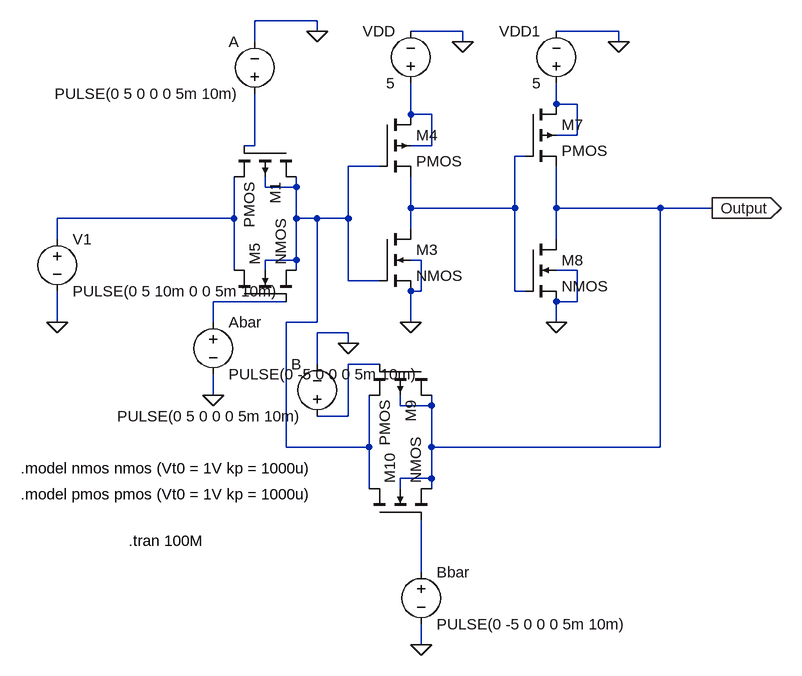
[diagram p0: schematic Exp 8 TG D flip flop.asc]
Exp 8 TG D flip flop.asc, the LTspice schematic file:
Version 4
SHEET 1 1020 792
WIRE 272 -208 176 -208
WIRE 272 -192 272 -208
WIRE 496 -192 416 -192
WIRE 736 -192 640 -192
WIRE 176 -176 176 -208
WIRE 496 -176 496 -192
WIRE 736 -176 736 -192
WIRE 640 -80 640 -112
WIRE 672 -80 640 -80
WIRE 416 -64 416 -112
WIRE 448 -64 416 -64
WIRE 672 -32 672 -80
WIRE 672 -32 640 -32
WIRE 176 -16 176 -96
WIRE 176 -16 160 -16
WIRE 448 -16 448 -64
WIRE 448 -16 416 -16
WIRE 592 0 576 0
WIRE 368 16 320 16
WIRE 192 48 192 32
WIRE 240 48 240 32
WIRE 240 48 192 48
WIRE 416 80 416 32
WIRE 576 80 576 0
WIRE 576 80 416 80
WIRE 640 80 640 16
WIRE 800 80 640 80
WIRE 880 80 800 80
WIRE 144 96 144 32
WIRE 144 96 -128 96
WIRE 240 96 240 48
WIRE 272 96 240 96
WIRE 320 96 320 16
WIRE 320 96 272 96
WIRE 416 112 416 80
WIRE -128 128 -128 96
WIRE 640 128 640 80
WIRE 240 160 240 96
WIRE 240 160 192 160
WIRE 432 160 416 160
WIRE 144 176 144 96
WIRE 192 176 192 160
WIRE 240 176 240 160
WIRE 672 176 640 176
WIRE 320 192 320 96
WIRE 368 192 320 192
WIRE 432 208 432 160
WIRE 432 208 416 208
WIRE 576 208 576 80
WIRE 592 208 576 208
WIRE 224 224 112 224
WIRE 672 224 672 176
WIRE 672 224 640 224
WIRE -128 256 -128 208
WIRE 112 256 112 224
WIRE 272 256 272 96
WIRE 272 256 224 256
WIRE 416 256 416 208
WIRE 640 256 640 224
WIRE 320 272 272 272
WIRE 320 288 320 272
WIRE 272 320 272 272
WIRE 368 320 320 320
WIRE 112 368 112 336
WIRE 400 384 400 368
WIRE 448 384 448 368
WIRE 448 384 400 384
WIRE 320 400 320 320
WIRE 320 400 272 400
WIRE 224 448 224 256
WIRE 352 448 352 368
WIRE 352 448 224 448
WIRE 448 448 448 384
WIRE 800 448 800 80
WIRE 800 448 448 448
WIRE 448 496 448 448
WIRE 448 496 400 496
WIRE 352 512 352 448
WIRE 400 512 400 496
WIRE 448 512 448 496
WIRE 432 640 432 560
WIRE 432 752 432 720
FLAG 416 256 0
FLAG 640 256 0
FLAG 496 -176 0
FLAG 736 -176 0
FLAG 320 288 0
FLAG 272 -192 0
FLAG 432 752 0
FLAG -128 256 0
FLAG 112 368 0
FLAG 880 80 Output
IOPIN 880 80 Out
SYMBOL nmos4 368 112 R0
SYMATTR InstName M3
SYMATTR Value2 l=5u w=10u
SYMBOL pmos4 368 -64 R0
SYMATTR InstName M4
SYMATTR Value2 l=5u w=20u
SYMBOL pmos4 592 -80 R0
SYMATTR InstName M7
SYMATTR Value2 l=5u w=20u
SYMBOL nmos4 592 128 R0
SYMATTR InstName M8
SYMATTR Value2 l=5u w=10u
SYMBOL voltage 416 -96 R180
WINDOW 0 24 96 Left 2
WINDOW 3 24 16 Left 2
WINDOW 123 0 0 Left 0
WINDOW 39 0 0 Left 0
SYMATTR InstName VDD
SYMATTR Value 5
SYMBOL voltage 640 -96 R180
WINDOW 0 24 96 Left 2
WINDOW 3 24 16 Left 2
WINDOW 123 0 0 Left 0
WINDOW 39 0 0 Left 0
SYMATTR InstName VDD1
SYMATTR Value 5
SYMBOL voltage 176 -80 R180
WINDOW 0 24 96 Left 2
WINDOW 3 24 16 Left 2
WINDOW 123 0 0 Left 0
WINDOW 39 0 0 Left 0
SYMATTR InstName A
SYMATTR Value PULSE(0 5 0 0 0 5m 10m)
SYMBOL voltage 272 416 R180
WINDOW 0 24 96 Left 2
WINDOW 3 24 16 Left 2
WINDOW 123 0 0 Left 0
WINDOW 39 0 0 Left 0
SYMATTR InstName B
SYMATTR Value PULSE(0 5 0 0 0 5m 10m)
SYMBOL voltage 112 240 R0
WINDOW 123 0 0 Left 0
WINDOW 39 0 0 Left 0
SYMATTR InstName Abar
SYMATTR Value PULSE(0 -5 0 0 0 5m 10m)
SYMBOL voltage 432 624 R0
WINDOW 123 0 0 Left 0
WINDOW 39 0 0 Left 0
SYMATTR InstName Bbar
SYMATTR Value PULSE(0 -5 0 0 0 5m 10m)
SYMBOL voltage -128 112 R0
WINDOW 123 0 0 Left 0
WINDOW 39 0 0 Left 0
SYMATTR InstName V1
SYMATTR Value PULSE(0 5 10m 0 0 5m 10m)
SYMBOL pmos4 240 -16 R90
SYMATTR InstName M1
SYMATTR Value2 l=5u w=20u
SYMBOL pmos4 448 320 R90
SYMATTR InstName M9
SYMATTR Value2 l=5u w=20u
SYMBOL nmos4 144 224 R270
SYMATTR InstName M5
SYMATTR Value2 l=5u w=10u
SYMBOL nmos4 352 560 R270
SYMATTR InstName M10
SYMATTR Value2 l=5u w=10u
TEXT -18 592 Left 2 !.tran 100M
TEXT -184 480 Left 2 !.model nmos nmos (Vt0 = 1V kp = 1000u)
TEXT -184 520 Left 2 !.model pmos pmos (Vt0 = 1V kp = 1000u)

The netlist it stands for:
* Exp 8 TG D flip flop.asc
M3 N004 N005 0 0 NMOS l=5u w=10u
M4 N002 N005 N004 N002 PMOS l=5u w=20u
M7 N001 N004 Output N001 PMOS l=5u w=20u
M8 Output N004 0 0 NMOS l=5u w=10u
VDD N002 0 5
VDD1 N001 0 5
V§A N003 0 PULSE(0 5 0 0 0 5m 10m)
V§B N008 0 PULSE(0 5 0 0 0 5m 10m)
V§Abar N007 0 PULSE(0 -5 0 0 0 5m 10m)
V§Bbar N009 0 PULSE(0 -5 0 0 0 5m 10m)
V1 N006 0 PULSE(0 5 10m 0 0 5m 10m)
M1 N005 N003 N006 N005 PMOS l=5u w=20u
M9 Output N008 N005 Output PMOS l=5u w=20u
M5 N006 N007 N005 N005 NMOS l=5u w=10u
M10 N005 N009 Output Output NMOS l=5u w=10u
.model NMOS NMOS
.model PMOS PMOS
.lib standard.mos
.tran 100M
.model nmos nmos (Vt0 = 1V kp = 1000u)
.model pmos pmos (Vt0 = 1V kp = 1000u)
.backanno
.end